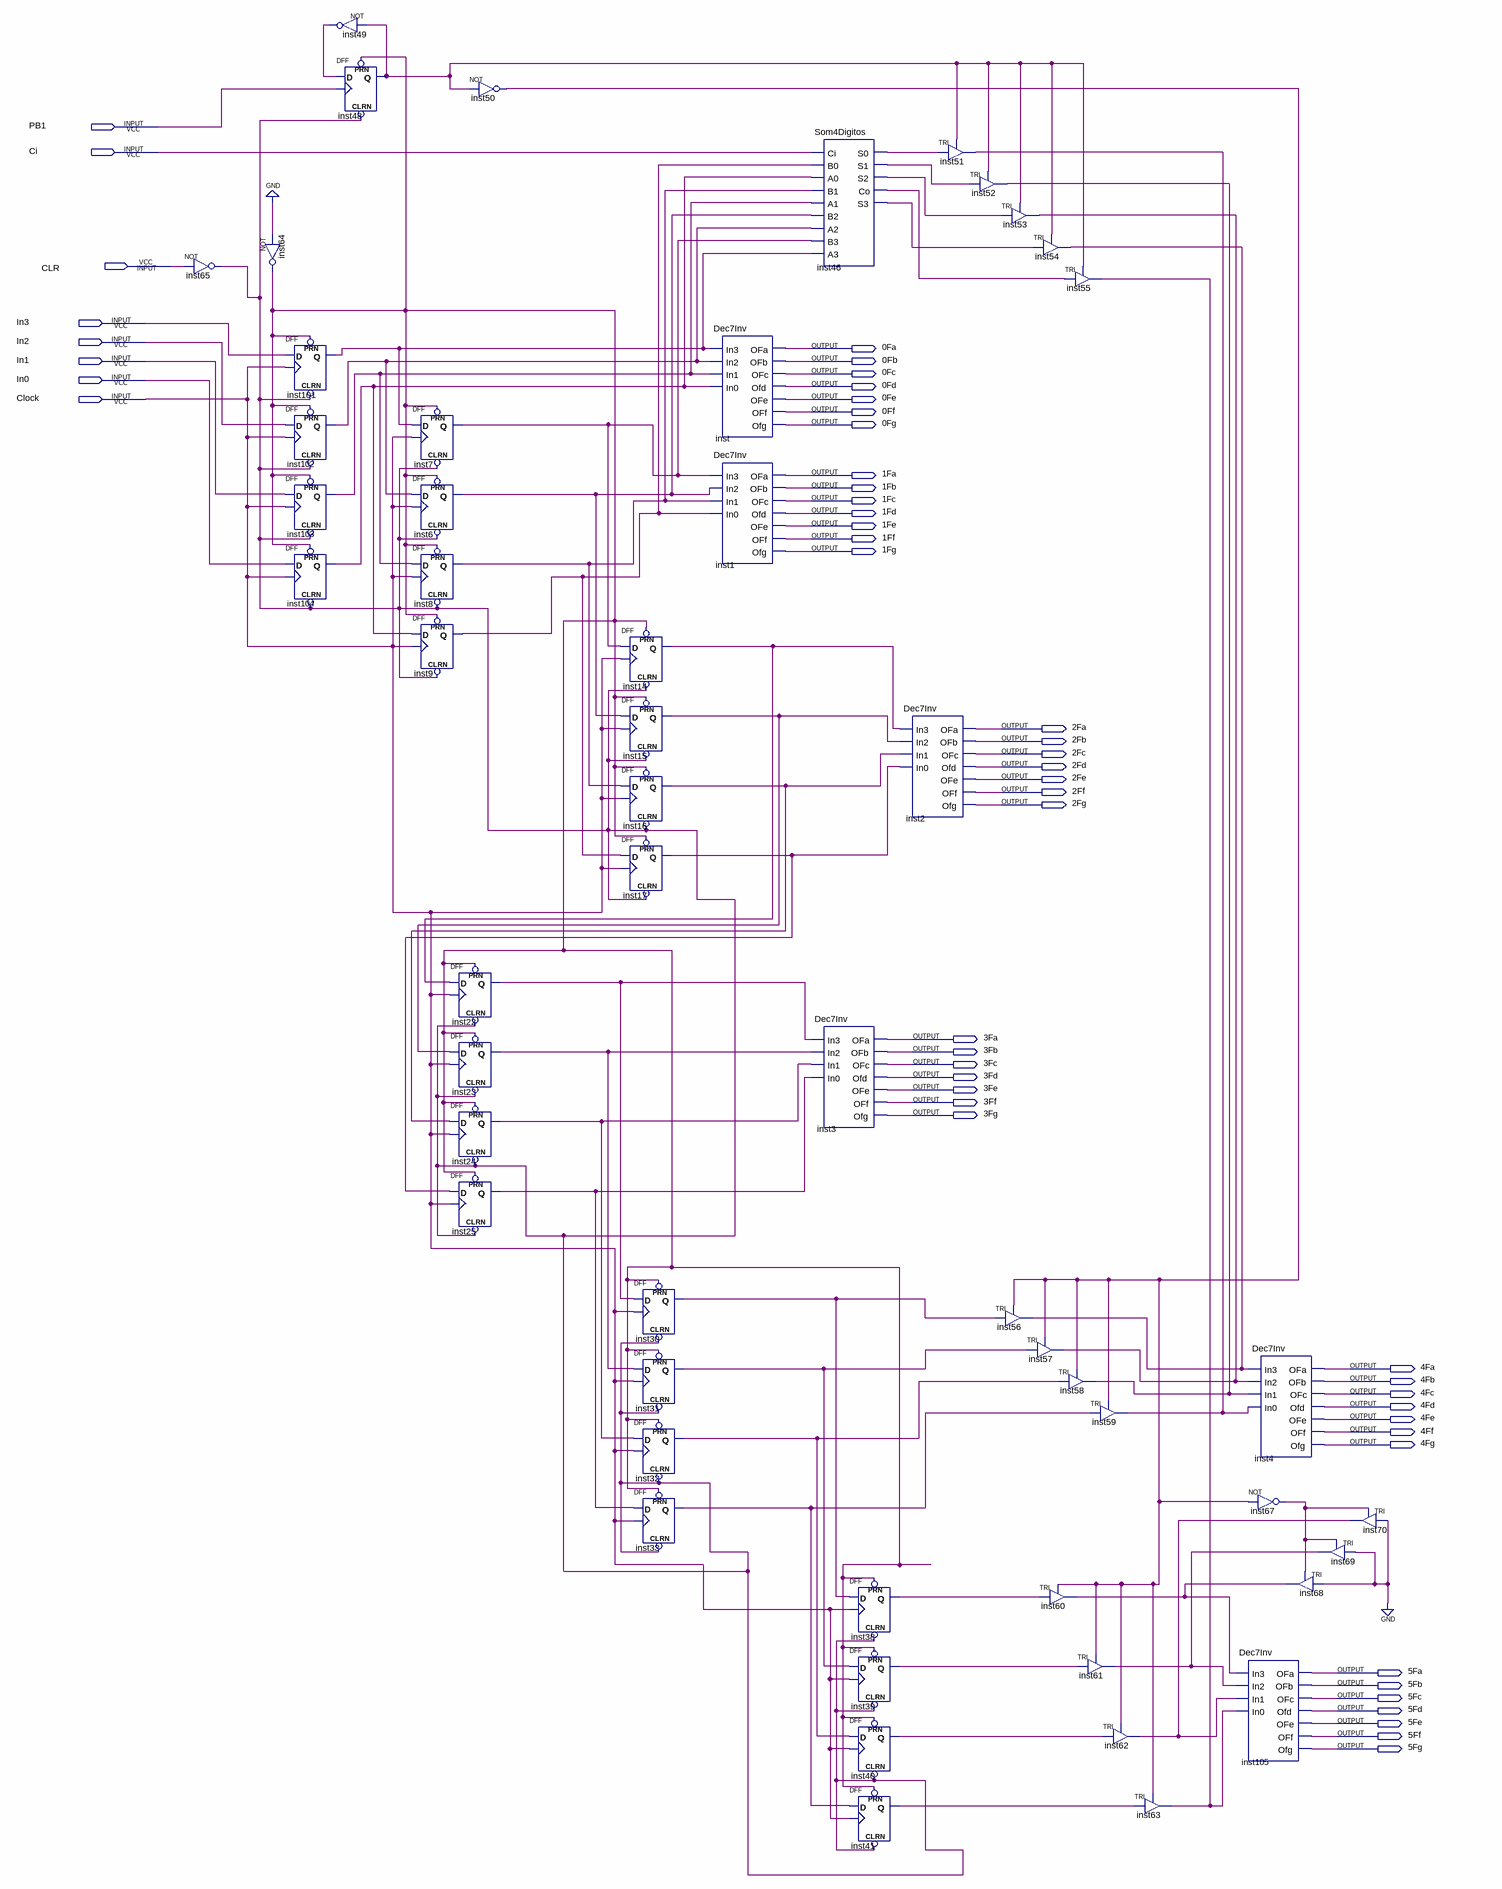
[diagram p0: schematic sheet]
// Quartus schematic Lab2.bdf as structural Verilog: 53 symbols, 50 pins
module Lab2 (
  input  PB1,
  input  Ci,
  input  CLR,
  input  In3,
  input  In2,
  input  In1,
  input  In0,
  input  Clock,
  output \0Fa ,
  output \0Fb ,
  output \0Fc ,
  output \0Fd ,
  output \0Fe ,
  output \0Ff ,
  output \0Fg ,
  output \1Fa ,
  output \1Fb ,
  output \1Fc ,
  output \1Fd ,
  output \1Fe ,
  output \1Ff ,
  output \1Fg ,
  output \2Fa ,
  output \2Fb ,
  output \2Fc ,
  output \2Fd ,
  output \2Fe ,
  output \2Ff ,
  output \2Fg ,
  output \3Fa ,
  output \3Fb ,
  output \3Fc ,
  output \3Fd ,
  output \3Fe ,
  output \3Ff ,
  output \3Fg ,
  output \4Fa ,
  output \4Fb ,
  output \4Fc ,
  output \4Fd ,
  output \4Fe ,
  output \4Ff ,
  output \4Fg ,
  output \5Fa ,
  output \5Fb ,
  output \5Fc ,
  output \5Fd ,
  output \5Fe ,
  output \5Ff ,
  output \5Fg 
);

  wire inst6_q, inst7_q, inst8_q, inst9_q, inst14_q, inst15_q, inst16_q, inst17_q, inst22_q, inst23_q,
       inst24_q, inst25_q, inst30_q, inst31_q, inst32_q, inst33_q, inst38_q, inst39_q, inst40_q, inst41_q,
       inst46_co, inst46_s0, inst46_s1, inst46_s2, inst46_s3, inst48_q, inst49_out, inst50_out, inst51_out,
       inst52_out, inst53_out, inst55_out, inst56_out, inst60_out, inst61_out, inst62_out, inst64_out,
       inst65_out, inst67_out, inst101_q, inst102_q, inst103_q, inst104_q;

  not inst65 (inst65_out, CLR);
  not inst64 (inst64_out, 1'b0);
  DFF inst101 (.CLRN(inst65_out), .CLK(Clock), .D(In3), .PRN(inst64_out), .Q(inst101_q));
  DFF inst102 (.CLRN(inst65_out), .CLK(Clock), .D(In2), .PRN(inst64_out), .Q(inst102_q));
  DFF inst103 (.CLRN(inst65_out), .CLK(Clock), .D(In1), .PRN(inst64_out), .Q(inst103_q));
  DFF inst104 (.CLRN(inst65_out), .CLK(Clock), .D(In0), .PRN(inst64_out), .Q(inst104_q));
  not inst49 (inst49_out, inst48_q);
  DFF inst48 (.CLRN(inst65_out), .CLK(PB1), .D(inst49_out), .PRN(inst64_out), .Q(inst48_q));
  DFF inst7 (.CLRN(inst65_out), .CLK(Clock), .D(inst101_q), .PRN(inst64_out), .Q(inst7_q));
  DFF inst6 (.CLRN(inst65_out), .CLK(Clock), .D(inst102_q), .PRN(inst64_out), .Q(inst6_q));
  DFF inst8 (.CLRN(inst65_out), .CLK(Clock), .D(inst103_q), .PRN(inst64_out), .Q(inst8_q));
  DFF inst9 (.CLRN(inst65_out), .CLK(Clock), .D(inst104_q), .PRN(inst64_out), .Q(inst9_q));
  DFF inst22 (.CLRN(inst65_out), .CLK(Clock), .D(inst14_q), .PRN(inst64_out), .Q(inst22_q));
  DFF inst23 (.CLRN(inst65_out), .CLK(Clock), .D(inst15_q), .PRN(inst64_out), .Q(inst23_q));
  DFF inst24 (.CLRN(inst65_out), .CLK(Clock), .D(inst16_q), .PRN(inst64_out), .Q(inst24_q));
  DFF inst25 (.CLRN(inst65_out), .CLK(Clock), .D(inst17_q), .PRN(inst64_out), .Q(inst25_q));
  not inst50 (inst50_out, inst48_q);
  DFF inst14 (.CLRN(inst65_out), .CLK(Clock), .D(inst7_q), .PRN(inst64_out), .Q(inst14_q));
  DFF inst15 (.CLRN(inst65_out), .CLK(Clock), .D(inst6_q), .PRN(inst64_out), .Q(inst15_q));
  DFF inst16 (.CLRN(inst65_out), .CLK(Clock), .D(inst8_q), .PRN(inst64_out), .Q(inst16_q));
  DFF inst17 (.CLRN(inst65_out), .CLK(Clock), .D(inst9_q), .PRN(inst64_out), .Q(inst17_q));
  DFF inst30 (.CLRN(inst65_out), .CLK(Clock), .D(inst22_q), .PRN(inst64_out), .Q(inst30_q));
  DFF inst31 (.CLRN(inst65_out), .CLK(Clock), .D(inst23_q), .PRN(inst64_out), .Q(inst31_q));
  DFF inst32 (.CLRN(inst65_out), .CLK(Clock), .D(inst24_q), .PRN(inst64_out), .Q(inst32_q));
  DFF inst33 (.CLRN(inst65_out), .CLK(Clock), .D(inst25_q), .PRN(inst64_out), .Q(inst33_q));
  Dec7Inv inst (
    .In3(inst101_q), .In2(inst102_q), .In1(inst103_q), .In0(inst104_q), .OFa(\0Fa ), .OFb(\0Fb ),
    .OFc(\0Fc ), .Ofd(\0Fd ), .OFe(\0Fe ), .OFf(\0Ff ), .Ofg(\0Fg ));
  Dec7Inv inst1 (
    .In3(inst7_q), .In2(inst6_q), .In1(inst8_q), .In0(inst9_q), .OFa(\1Fa ), .OFb(\1Fb ), .OFc(\1Fc ),
    .Ofd(\1Fd ), .OFe(\1Fe ), .OFf(\1Ff ), .Ofg(\1Fg ));
  Som4Digitos inst46 (
    .Ci(Ci), .B0(inst9_q), .A0(inst104_q), .B1(inst8_q), .A1(inst103_q), .B2(inst6_q), .A2(inst102_q),
    .B3(inst7_q), .A3(inst101_q), .S0(inst46_s0), .S1(inst46_s1), .S2(inst46_s2), .Co(inst46_co),
    .S3(inst46_s3));
  Dec7Inv inst3 (
    .In3(inst22_q), .In2(inst23_q), .In1(inst24_q), .In0(inst25_q), .OFa(\3Fa ), .OFb(\3Fb ), .OFc(\3Fc ),
    .Ofd(\3Fd ), .OFe(\3Fe ), .OFf(\3Ff ), .Ofg(\3Fg ));
  DFF inst38 (.CLRN(inst65_out), .CLK(Clock), .D(inst30_q), .PRN(inst64_out), .Q(inst38_q));
  DFF inst39 (.CLRN(inst65_out), .CLK(Clock), .D(inst31_q), .PRN(inst64_out), .Q(inst39_q));
  DFF inst40 (.CLRN(inst65_out), .CLK(Clock), .D(inst32_q), .PRN(inst64_out), .Q(inst40_q));
  DFF inst41 (.CLRN(inst65_out), .CLK(Clock), .D(inst33_q), .PRN(inst64_out), .Q(inst41_q));
  Dec7Inv inst2 (
    .In3(inst14_q), .In2(inst15_q), .In1(inst16_q), .In0(inst17_q), .OFa(\2Fa ), .OFb(\2Fb ), .OFc(\2Fc ),
    .Ofd(\2Fd ), .OFe(\2Fe ), .OFf(\2Ff ), .Ofg(\2Fg ));
  TRI inst51 (.IN(inst46_s0), .OE(inst48_q), .OUT(inst51_out));
  TRI inst52 (.IN(inst46_s1), .OE(inst48_q), .OUT(inst52_out));
  TRI inst53 (.IN(inst46_s2), .OE(inst48_q), .OUT(inst53_out));
  TRI inst56 (.IN(inst30_q), .OE(inst50_out), .OUT(inst56_out));
  TRI inst54 (.IN(inst46_s3), .OE(inst48_q), .OUT(inst56_out));
  TRI inst57 (.IN(inst31_q), .OE(inst50_out), .OUT(inst53_out));
  TRI inst58 (.IN(inst32_q), .OE(inst50_out), .OUT(inst52_out));
  TRI inst60 (.IN(inst38_q), .OE(inst50_out), .OUT(inst60_out));
  TRI inst55 (.IN(inst46_co), .OE(inst48_q), .OUT(inst55_out));
  TRI inst59 (.IN(inst33_q), .OE(inst50_out), .OUT(inst51_out));
  TRI inst61 (.IN(inst39_q), .OE(inst50_out), .OUT(inst61_out));
  TRI inst62 (.IN(inst40_q), .OE(inst50_out), .OUT(inst62_out));
  TRI inst63 (.IN(inst41_q), .OE(inst50_out), .OUT(inst55_out));
  Dec7Inv inst4 (
    .In3(inst56_out), .In2(inst53_out), .In1(inst52_out), .In0(inst51_out), .OFa(\4Fa ), .OFb(\4Fb ),
    .OFc(\4Fc ), .Ofd(\4Fd ), .OFe(\4Fe ), .OFf(\4Ff ), .Ofg(\4Fg ));
  not inst67 (inst67_out, inst50_out);
  Dec7Inv inst105 (
    .In3(inst60_out), .In2(inst61_out), .In1(inst62_out), .In0(inst55_out), .OFa(\5Fa ), .OFb(\5Fb ),
    .OFc(\5Fc ), .Ofd(\5Fd ), .OFe(\5Fe ), .OFf(\5Ff ), .Ofg(\5Fg ));
  TRI inst68 (.IN(1'b0), .OE(inst67_out), .OUT(inst60_out));
  TRI inst70 (.IN(1'b0), .OE(inst67_out), .OUT(inst62_out));
  TRI inst69 (.IN(1'b0), .OE(inst67_out), .OUT(inst61_out));
endmodule
